# Altium schematic sheet requirements.SchDoc
size A4; SheetNumber: 2; SheetTotal: 3
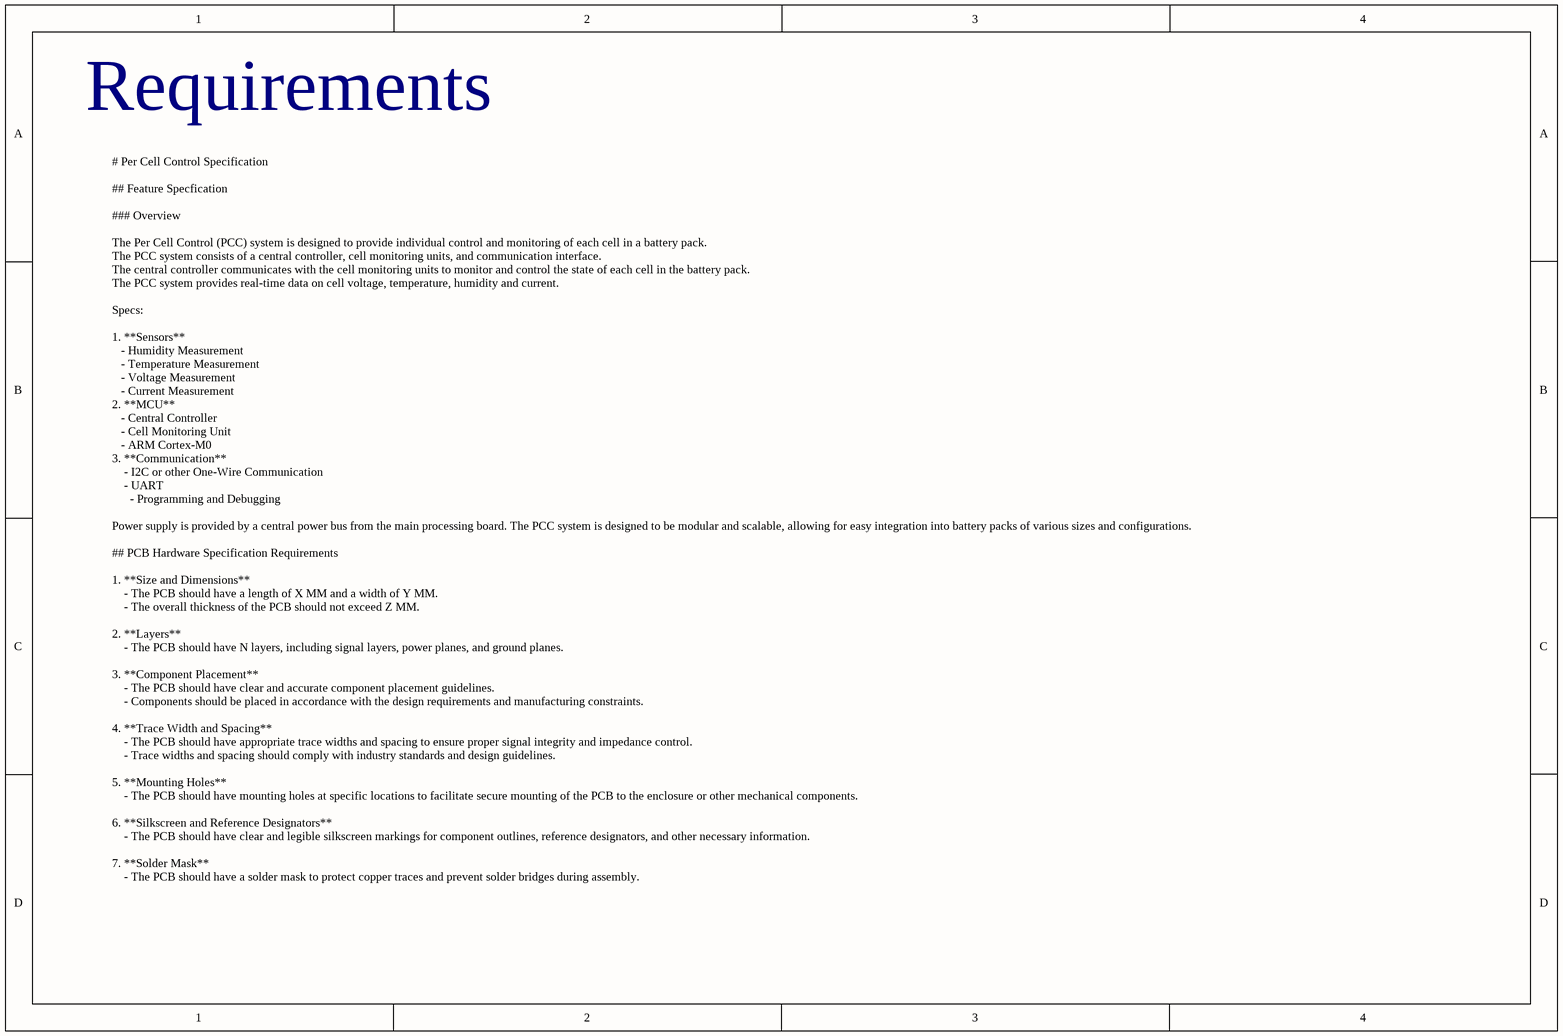
[diagram p0: requirements.SchDoc]

## Notes on the sheet
- Requirements
- # Per Cell Control Specification
  ## Feature Specfication
  ### Overview
  The Per Cell Control (PCC) system is designed to provide individual control and monitoring of each cell in a battery pack.
  The PCC system consists of a central controller, cell monitoring units, and communication interface.
  The central controller communicates with the cell monitoring units to monitor and control the state of each cell in the battery pack.
  The PCC system provides real-time data on cell voltage, temperature, humidity and current.
  Specs:
  1. **Sensors**
  - Humidity Measurement
  - Temperature Measurement
  - Voltage Measurement
  - Current Measurement
  2. **MCU**
  - Central Controller
  - Cell Monitoring Unit
  - ARM Cortex-M0
  3. **Communication**
  - I2C or other One-Wire Communication
  - UART
  - Programming and Debugging
  Power supply is provided by a central power bus from the main processing board. The PCC system is designed to be modular and scalable, allowing for easy integration into battery packs of various sizes and configurations.
  ## PCB Hardware Specification Requirements
  1. **Size and Dimensions**
  - The PCB should have a length of X MM and a width of Y MM.
  - The overall thickness of the PCB should not exceed Z MM.
  2. **Layers**
  - The PCB should have N layers, including signal layers, power planes, and ground planes.
  3. **Component Placement**
  - The PCB should have clear and accurate component placement guidelines.
  - Components should be placed in accordance with the design requirements and manufacturing constraints.
  4. **Trace Width and Spacing**
  - The PCB should have appropriate trace widths and spacing to ensure proper signal integrity and impedance control.
  - Trace widths and spacing should comply with industry standards and design guidelines.
  5. **Mounting Holes**
  - The PCB should have mounting holes at specific locations to facilitate secure mounting of the PCB to the enclosure or other mechanical components.
  6. **Silkscreen and Reference Designators**
  - The PCB should have clear and legible silkscreen markings for component outlines, reference designators, and other necessary information.
  7. **Solder Mask**
  - The PCB should have a solder mask to protect copper traces and prevent solder bridges during assembly.
  8. **Testing Points**
  - The PCB should have designated testing points for easy access during manufacturing and testing processes.
  9. **Connector and Interface Requirements**
  - The PCB should have specific connector and interface requirements, including pinouts, signal assignments, and mechanical dimensions.
  10. **Environmental Considerations**
  - The PCB should meet environmental requirements such as temperature, humidity, and vibration resistance.